# Altium project Switchy Backlight.PrjPcb
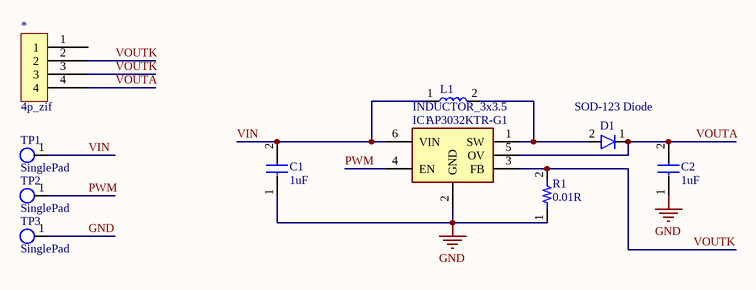
[diagram p0: Sheet1.SchDoc]
1 sheet, 10 parts. Net scope: global (net labels, ports and power ports of the same name join across sheets).

## Sheet Sheet1.SchDoc
size A4; SheetNumber: 1; SheetTotal: 1

### Parts
*  4p_zif  [4p_smd_zif]
C1  1uF  [0603 Capacitor]
C2  1uF  [0603 Capacitor]
D1  SOD-123 Diode  [SOD123]
IC1  AP3032KTR-G1  [SOT95P280X145-6N]
L1  INDUCTOR_3x3.5  [INDUCTOR_3x3.5]
R1  0.01R  [0603 Resistor]
TP1  SinglePad  [SinglePad1]
TP2  SinglePad  [SinglePad1]
TP3  SinglePad  [SinglePad1]

### Nets
GND: C1.1 C2.1 IC1.2(GND) R1.1 TP3.1
PWM: IC1.4(EN) TP2.1
VIN: C1.2 IC1.6(VIN) L1.1 TP1.1
VOUTA: *.4 C2.2 D1.1(K) IC1.5(OV)
VOUTK: *.2 *.3 IC1.3(FB) R1.2
NetD1_2: D1.2(A) IC1.1(SW) L1.2

Not connected (* = marked no-connect by the designer): * 1

### Library data of the parts
C1 C2 = 0603 Capacitor: Capacitor; Manufacturer_Name: AVX; Manufacturer_Part_Number: 06031A120JAT2A; Datasheet Link: http://www.mouser.com/catalog/supplier/library/pdf/AVXSurfaceMountCeramic.pdf; Height: 0.9mm; Mouser Part Number: 581-06031A120J; Mouser Price/Stock: https://www.mouser.co.uk/ProductDetail/AVX/06031A120JAT2A?qs=tMrmimOZp5UsY%252BxF6dNGxQ%3D%3D; Arrow Part Number: 06031A120JAT2A; Arrow Price/Stock: https://www.arrow.com/en/products/06031a120jat2a/avx
D1 = SOD-123 Diode: Diode; Manufacturer_Name: Vishay; Manufacturer_Part_Number: 1N4148W-G3-08; Datasheet Link: https://componentsearchengine.com/Datasheets/1/1N4148W-G3-08.pdf; Height: 1.35mm; Mouser Part Number: 78-1N4148W-G3-08; Mouser Price/Stock: https://www.mouser.co.uk/ProductDetail/Vishay-Semiconductors/1N4148W-G3-08?qs=uS%252BVSIFnvp46StDBB15x4Q%3D%3D; Arrow Part Number: 1N4148W-G3-08; Arrow Price/Stock: https://www.arrow.com/en/products/1n4148w-g3-08/vishay
IC1 = AP3032KTR-G1: Integrated Circuit; Manufacturer_Name: Diodes Inc.; Datasheet Link: https://www.diodes.com/assets/Datasheets/AP3032.pdf; Height: 1.45mm; Manufacturer_Part_Number: AP3032KTR-G1; Mouser Part Number: 621-AP3032KTR-G1; Mouser Price/Stock: https://www.mouser.co.uk/ProductDetail/Diodes-Incorporated/AP3032KTR-G1?qs=x6A8l6qLYDBKP%252BiASla%2FZw%3D%3D; Arrow Part Number: AP3032KTR-G1; Arrow Price/Stock: https://www.arrow.com/en/products/ap3032ktr-g1/diodes-incorporated?region=nac
L1 = INDUCTOR_3x3.5: Inductor; Manufacturer_Name: Shuo Xing; Manufacturer_Part_Number: CD32-4R7M; Datasheet Link: http://aitendo3.sakura.ne.jp/aitendo_data/product_img/parts/coil/CD32/CD32.pdf; Height: 2.4mm
R1 = 0603 Resistor: Resistor; Manufacturer_Name: TE Connectivity; Manufacturer_Part_Number: CPF0603B100RE1; Datasheet Link: http://www.farnell.com/datasheets/1786775.pdf; Height: 0.55mm; Mouser Part Number: 279-CPF0603B100RE1; Mouser Price/Stock: https://www.mouser.co.uk/ProductDetail/TE-Connectivity-Neohm/CPF0603B100RE1?qs=DfH2yQaBz6s2KWheq2AlNw%3D%3D; Arrow Part Number: CPF0603B100RE1; Arrow Price/Stock: https://www.arrow.com/en/products/cpf0603b100re1/te-connectivity